# Altium schematic sheet Схема версия 3.1.SchDoc
size 594 x 420 mm; Author: ALTIUM GOSTBOM2.0 KEV; SheetNumber: 1; SheetTotal: 1; Обозначение_Код: НАПК0001.00.01Р; Наименование2: Модуль вычислительный; Вид_документа_SCH: Схема принципиальная; Наименование_организации: Неясыти Аэро; п_Разраб_Р: Хейфец С.С.; п_Пров_Р: Хрущев А.С.; п_Утв_Р: Хейфец С.С.
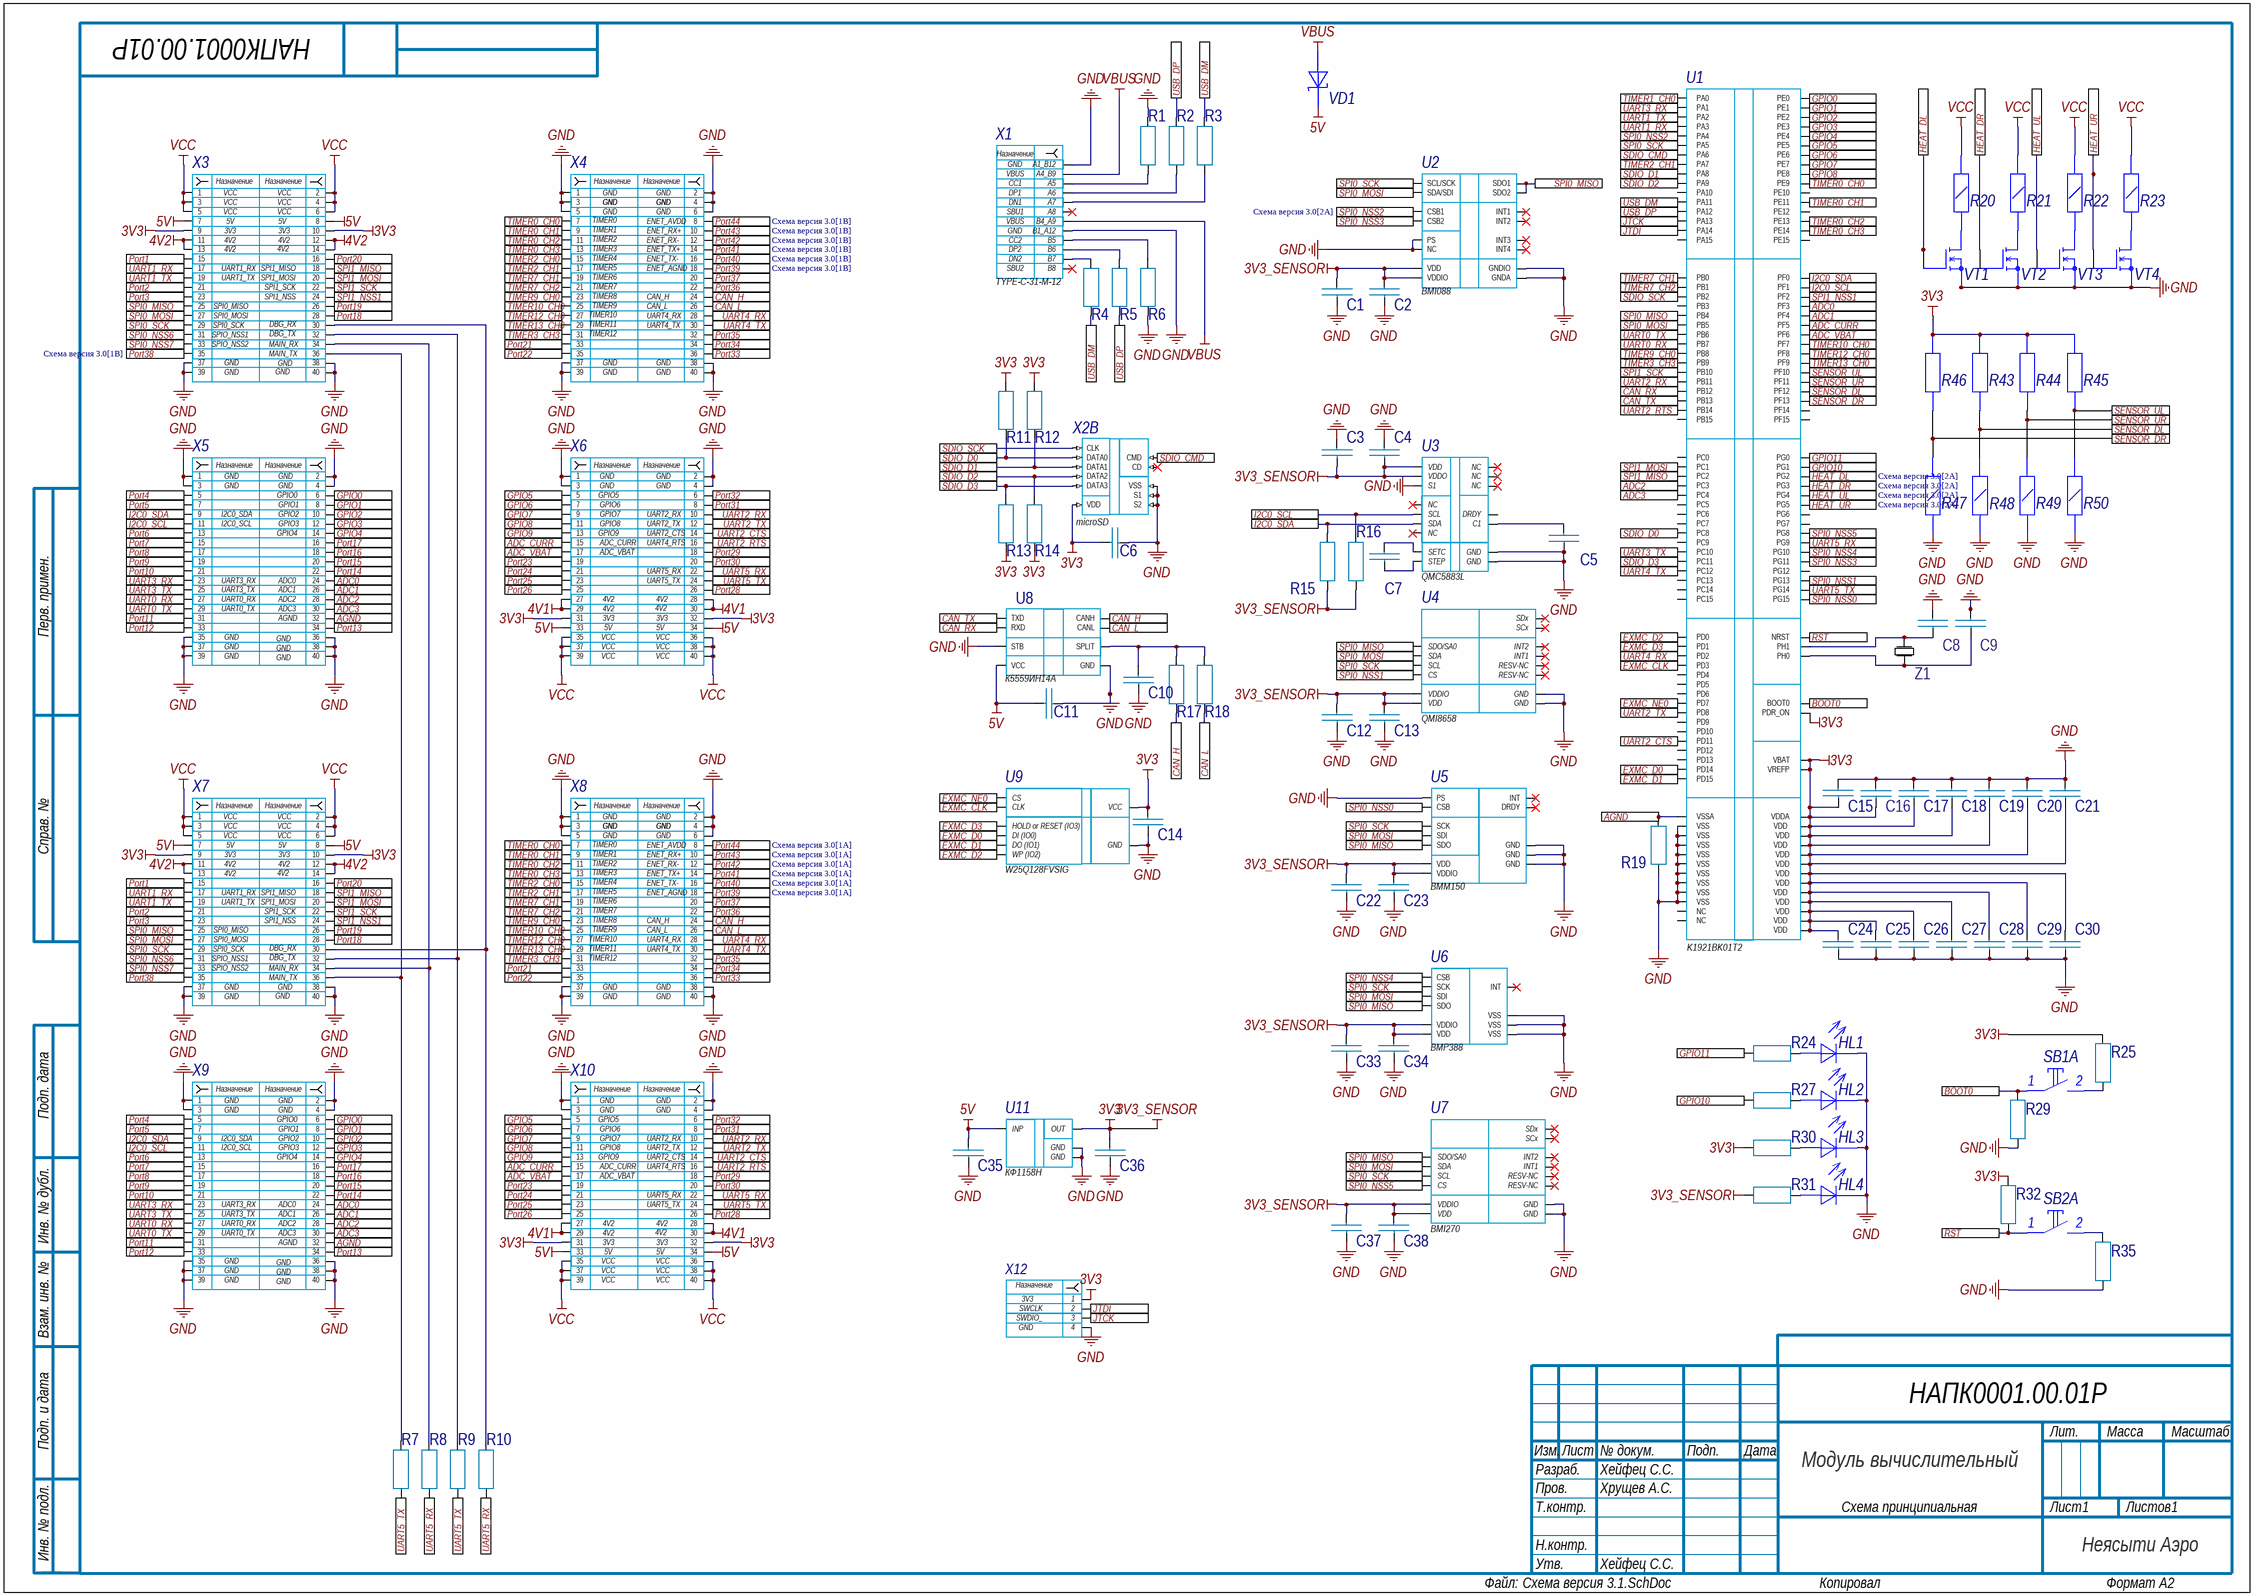
[diagram p0: Схема версия 3.1.SchDoc]

## Parts
C1  100nF  [C0603]  (value not drawn)
C2  100nF  [C0603]  (value not drawn)
C3  100nF  [C0603]  (value not drawn)
C4  100nF  [C0603]  (value not drawn)
C5  4u7F  [C1206]  (value not drawn)
C6  100nF  [C0603]  (value not drawn)
C7  200nF  [C0603]  (value not drawn)
C8  18pF  [C0603]  (value not drawn)
C9  18pF  [C0603]  (value not drawn)
C10  47nF  [C0603]  (value not drawn)
C11  100nF  [C0603]  (value not drawn)
C12  100nF  [C0603]  (value not drawn)
C13  100nF  [C0603]  (value not drawn)
C14  100nF  [C0603]  (value not drawn)
C15  100nF  [C0603]  (value not drawn)
C16  100nF  [C0603]  (value not drawn)
C17  100nF  [C0603]  (value not drawn)
C18  100nF  [C0603]  (value not drawn)
C19  100nf  [C0603]  (value not drawn)
C20  100nF  [C0603]  (value not drawn)
C21  100nF  [C0603]  (value not drawn)
C22  100nF  [C0603]  (value not drawn)
C23  100nF  [C0603]  (value not drawn)
C24  100nF  [C0603]  (value not drawn)
C25  100nF  [C0603]  (value not drawn)
C26  100nF  [C0603]  (value not drawn)
C27  100nF  [C0603]  (value not drawn)
C28  100nF  [C0603]  (value not drawn)
C29  100nF  [C0603]  (value not drawn)
C30  100nF  [C0603]  (value not drawn)
C33  100nF  [C0603]  (value not drawn)
C34  C1_POSTOYANNYJ  [C0603]  (value not drawn)
C35  1uF  [C0603]  (value not drawn)
C36  1uF  [C0603]  (value not drawn)
C37  C1_POSTOYANNYJ  [C0603]  (value not drawn)
C38  100nF  [C0603]  (value not drawn)
HL1  t  [LD0805]  (value not drawn)
HL2  t  [LD0805]  (value not drawn)
HL3  t  [LD0805]  (value not drawn)
HL4  t  [LD0805]  (value not drawn)
R1  5K1  [R0603]  (value not drawn)
R2  100  [R0603]  (value not drawn)
R3  100  [R0603]  (value not drawn)
R4  100  [R0603]  (value not drawn)
R5  100  [R0603]  (value not drawn)
R6  5K1  [R0603]  (value not drawn)
R7  0  [R0603]  (value not drawn)
R8  0  [R0603]  (value not drawn)
R9  0  [R0603]  (value not drawn)
R10  0  [R0603]  (value not drawn)
R11  100K  [R0603]  (value not drawn)
R12  100K  [R0603]  (value not drawn)
R13  100K  [R0603]  (value not drawn)
R14  100K  [R0603]  (value not drawn)
R15  10K  [R0603]  (value not drawn)
R16  10K  [R0603]  (value not drawn)
R17  60  [R0603]  (value not drawn)
R18  60  [R0603]  (value not drawn)
R19  0  [R0603]  (value not drawn)
R20  0020ab 1K8 2512  [R2512]  (value not drawn)
R21  0020ab 1K8 2512  [R2512]  (value not drawn)
R22  0020ab 1K8 2512  [R2512]  (value not drawn)
R23  0020ab 1K8 2512  [R2512]  (value not drawn)
R24  100  [R0603]  (value not drawn)
R25  10K  [R0603]  (value not drawn)
R27  100  [R0603]  (value not drawn)
R29  0  [R0603]  (value not drawn)
R30  100  [R0603]  (value not drawn)
R31  100  [R0603]  (value not drawn)
R32  10K  [R0603]  (value not drawn)
R35  0  [R0603]  (value not drawn)
R43  10K  [R0603]  (value not drawn)
R44  10K  [R0603]  (value not drawn)
R45  10K  [R0603]  (value not drawn)
R46  10K  [R0603]  (value not drawn)
R47  NCP15XH103F03RC  [R0603]  (value not drawn)
R48  NCP15XH103F03RC  [R0603]  (value not drawn)
R49  NCP15XH103F03RC  [R0603]  (value not drawn)
R50  NCP15XH103F03RC  [R0603]  (value not drawn)
SB1  Text  [DTSM-32]  (value not drawn)  (part A of 2)
SB2  Text  [DTSM-32]  (value not drawn)  (part A of 2)
U1  K1921BK01T2  [QFP50P2200X2200X160-144N]
U2  BMI088  [PQFN50P450X300X100-16N]
U3  QMC5883L  [PLCC16-0.5-3X3MM]
U4  QMI8658  [XDCR_BMI270]
U5  BMM150  [XDCR_BMM150]
U6  BMP388  [PQFN50P200X200X80-10N]
U7  BMI270  [XDCR_BMI270]
U8  К5559ИН14А  [SOIC127P600X175-8N]
U9  W25Q128FVSIG  [SOIC127P790X216-8N]
U11  КФ1158Н  [SOT-428]
VD1  Schottky  [SOD-123]  (value not drawn)
VT1  КТ234В9  [SOT-23]  (value not drawn)
VT2  КТ234В9  [SOT-23]  (value not drawn)
VT3  КТ234В9  [SOT-23]  (value not drawn)
VT4  КТ234В9  [SOT-23]  (value not drawn)
X1  TYPE-C-31-M-12  [HRO_TYPE-C-31-M-12]
X2  microSD  [MICROSD]  (part B of 2)
X3  Header 2x20  [PBD1.27-40SA]  (value not drawn)
X4  Header 2x20  [PBD1.27-40SA]  (value not drawn)
X5  Header 2x20  [PBD1.27-40SA]  (value not drawn)
X6  Header 2x20  [PBD1.27-40SA]  (value not drawn)
X7  Header 2x20  [Headr 2x20 female]  (value not drawn)
X8  Header 2x20  [Headr 2x20 female]  (value not drawn)
X9  Header 2x20  [Headr 2x20 female]  (value not drawn)
X10  Header 2x20  [Headr 2x20 female]  (value not drawn)
X12  Header 1x4  [PicoBlade 4pin]  (value not drawn)
Z1  KSE-7I08000MAF343ZA3  [XTAL_NX5032GA-8.000M-STD-CSU-1]  (value not drawn)

## Ports
ADC0 (see Схема версия 3.0[1A], Схема версия 3.0[1B]), ADC0 (see Схема версия 3.0[1A], Схема версия 3.0[2A]), ADC0 (see Схема версия 3.0[1B], Схема версия 3.0[2A]), ADC1 (see Схема версия 3.0[1A], Схема версия 3.0[1B]), ADC1 (see Схема версия 3.0[1A], Схема версия 3.0[2A]), ADC1 (see Схема версия 3.0[1B], Схема версия 3.0[2A]), ADC2 (see Схема версия 3.0[1A], Схема версия 3.0[1B]), ADC2 (see Схема версия 3.0[1A], Схема версия 3.0[2A]), ADC2 (see Схема версия 3.0[1B], Схема версия 3.0[2A]), ADC3 (see Схема версия 3.0[1A], Схема версия 3.0[1B]), ADC3 (see Схема версия 3.0[1A], Схема версия 3.0[2A]), ADC3 (see Схема версия 3.0[1B], Схема версия 3.0[2A]), ADC_CURR (see Схема версия 3.0[1A], Схема версия 3.0[1B]), ADC_CURR (see Схема версия 3.0[1A], Схема версия 3.0[2A]), ADC_CURR (see Схема версия 3.0[1B], Схема версия 3.0[2A]), ADC_VBAT (see Схема версия 3.0[1A], Схема версия 3.0[1B]), ADC_VBAT (see Схема версия 3.0[1A], Схема версия 3.0[2A]), ADC_VBAT (see Схема версия 3.0[1B], Схема версия 3.0[2A]), AGND (see Схема версия 3.0[1A], Схема версия 3.0[1B]), AGND (see Схема версия 3.0[1A], Схема версия 3.0[2B]), AGND (see Схема версия 3.0[1B], Схема версия 3.0[2B]), BOOT0 (see Схема версия 3.0[2A]), BOOT0 (see Схема версия 3.0[2B]), CAN_H (see Схема версия 3.0[1A], Схема версия 3.0[1B]), CAN_H (see Схема версия 3.0[1A], Схема версия 3.0[1B], Схема версия 3.0[2A]), CAN_H (see Схема версия 3.0[1A], Схема версия 3.0[2A]), CAN_L (see Схема версия 3.0[1A], Схема версия 3.0[1B]), CAN_L (see Схема версия 3.0[1A], Схема версия 3.0[1B], Схема версия 3.0[2A]), CAN_L (see Схема версия 3.0[1A], Схема версия 3.0[2A]), CAN_RX (see Схема версия 3.0[1A]), CAN_RX (see Схема версия 3.0[2A]), CAN_TX (see Схема версия 3.0[1A]), CAN_TX (see Схема версия 3.0[2A]), EXMC_CLK (see Схема версия 3.0[1B]), EXMC_CLK (see Схема версия 3.0[2A]), EXMC_D0 (see Схема версия 3.0[1B]), EXMC_D0 (see Схема версия 3.0[2A]), EXMC_D1 (see Схема версия 3.0[1B]), EXMC_D1 (see Схема версия 3.0[2A]), EXMC_D2 (see Схема версия 3.0[1B]), EXMC_D2 (see Схема версия 3.0[2A]), EXMC_D3 (see Схема версия 3.0[1B]), EXMC_D3 (see Схема версия 3.0[2A]), EXMC_NE0 (see Схема версия 3.0[1A]), EXMC_NE0 (see Схема версия 3.0[2A]), GPIO0 (see Схема версия 3.0[1A], Схема версия 3.0[1B]), GPIO0 (see Схема версия 3.0[1A], Схема версия 3.0[2A]), GPIO0 (see Схема версия 3.0[1B], Схема версия 3.0[2A]), GPIO1 (see Схема версия 3.0[1A], Схема версия 3.0[1B]), GPIO1 (see Схема версия 3.0[1A], Схема версия 3.0[2A]), GPIO1 (see Схема версия 3.0[1B], Схема версия 3.0[2A]), GPIO2 (see Схема версия 3.0[1A], Схема версия 3.0[1B]), GPIO2 (see Схема версия 3.0[1A], Схема версия 3.0[2A]), GPIO2 (see Схема версия 3.0[1B], Схема версия 3.0[2A]), GPIO3 (see Схема версия 3.0[1A], Схема версия 3.0[1B]), GPIO3 (see Схема версия 3.0[1A], Схема версия 3.0[2A]), GPIO3 (see Схема версия 3.0[1B], Схема версия 3.0[2A]), GPIO4 (see Схема версия 3.0[1A], Схема версия 3.0[1B]), GPIO4 (see Схема версия 3.0[1A], Схема версия 3.0[2A]), GPIO4 (see Схема версия 3.0[1B], Схема версия 3.0[2A]), GPIO5 (see Схема версия 3.0[1A], Схема версия 3.0[1B]), GPIO5 (see Схема версия 3.0[1A], Схема версия 3.0[2A]), GPIO5 (see Схема версия 3.0[1B], Схема версия 3.0[2A]), GPIO6 (see Схема версия 3.0[1A], Схема версия 3.0[1B]), GPIO6 (see Схема версия 3.0[1A], Схема версия 3.0[2A]), GPIO6 (see Схема версия 3.0[1B], Схема версия 3.0[2A]), GPIO7 (see Схема версия 3.0[1A], Схема версия 3.0[1B]), GPIO7 (see Схема версия 3.0[1A], Схема версия 3.0[2A]), GPIO7 (see Схема версия 3.0[1B], Схема версия 3.0[2A]), GPIO8 (see Схема версия 3.0[1A], Схема версия 3.0[1B]), GPIO8 (see Схема версия 3.0[1A], Схема версия 3.0[2A]), GPIO8 (see Схема версия 3.0[1B], Схема версия 3.0[2A]), GPIO9 (see Схема версия 3.0[1A]), GPIO9 (see Схема версия 3.0[1B]), GPIO10 (see Схема версия 3.0[2A]), GPIO10 (see Схема версия 3.0[2B]), GPIO11 (see Схема версия 3.0[2A]), GPIO11 (see Схема версия 3.0[2B]), HEAT_DL (see Схема версия 3.0[2A]), HEAT_DR (see Схема версия 3.0[2A]), HEAT_UL (see Схема версия 3.0[2A]), HEAT_UR (see Схема версия 3.0[2A]), I2C0_SCL (see Схема версия 3.0[1A], Схема версия 3.0[1B], Схема версия 3.0[2A]), I2C0_SCL (see Схема версия 3.0[1A], Схема версия 3.0[2A]), I2C0_SCL (see Схема версия 3.0[1B], Схема версия 3.0[2A]), I2C0_SDA (see Схема версия 3.0[1A], Схема версия 3.0[1B], Схема версия 3.0[2A]), I2C0_SDA (see Схема версия 3.0[1A], Схема версия 3.0[2A]), I2C0_SDA (see Схема версия 3.0[1B], Схема версия 3.0[2A]), JTCK (see Схема версия 3.0[1B]), JTCK (see Схема версия 3.0[2A]), JTDI (see Схема версия 3.0[1B]), JTDI (see Схема версия 3.0[2A]), Port1 (see Схема версия 3.0[1A]), Port1 (see Схема версия 3.0[1B]), Port2 (see Схема версия 3.0[1A]), Port2 (see Схема версия 3.0[1B]), Port3 (see Схема версия 3.0[1A]), Port3 (see Схема версия 3.0[1B]), Port4 (see Схема версия 3.0[1A]), Port4 (see Схема версия 3.0[1B]), Port5 (see Схема версия 3.0[1A]), Port5 (see Схема версия 3.0[1B]), Port6 (see Схема версия 3.0[1A]), Port6 (see Схема версия 3.0[1B]), Port7 (see Схема версия 3.0[1A]), Port7 (see Схема версия 3.0[1B]), Port8 (see Схема версия 3.0[1A]), Port8 (see Схема версия 3.0[1B]), Port9 (see Схема версия 3.0[1A]), Port9 (see Схема версия 3.0[1B]), Port10 (see Схема версия 3.0[1A]), Port10 (see Схема версия 3.0[1B]), Port11 (see Схема версия 3.0[1A]), Port11 (see Схема версия 3.0[1B]), Port12 (see Схема версия 3.0[1A]), Port12 (see Схема версия 3.0[1B]), Port13 (see Схема версия 3.0[1A]), Port13 (see Схема версия 3.0[1B]), Port14 (see Схема версия 3.0[1A]), Port14 (see Схема версия 3.0[1B]), Port15 (see Схема версия 3.0[1A]), Port15 (see Схема версия 3.0[1B]), Port16 (see Схема версия 3.0[1A]), Port16 (see Схема версия 3.0[1B]), Port17 (see Схема версия 3.0[1A]), Port17 (see Схема версия 3.0[1B]), Port18 (see Схема версия 3.0[1A]), Port18 (see Схема версия 3.0[1B]), Port19 (see Схема версия 3.0[1A]), Port19 (see Схема версия 3.0[1B]), Port20 (see Схема версия 3.0[1A]), Port20 (see Схема версия 3.0[1B]), Port21 (see Схема версия 3.0[1A]), Port21 (see Схема версия 3.0[1B]), Port22 (see Схема версия 3.0[1A]), Port22 (see Схема версия 3.0[1B]), Port23 (see Схема версия 3.0[1A]), Port23 (see Схема версия 3.0[1B]), Port24 (see Схема версия 3.0[1A]), Port24 (see Схема версия 3.0[1B]), Port25 (see Схема версия 3.0[1A]), Port25 (see Схема версия 3.0[1B]), Port26 (see Схема версия 3.0[1A]), Port26 (see Схема версия 3.0[1B]), Port28 (see Схема версия 3.0[1A]), Port28 (see Схема версия 3.0[1B]), Port29 (see Схема версия 3.0[1A]), Port29 (see Схема версия 3.0[1B]), Port30 (see Схема версия 3.0[1A]), Port30 (see Схема версия 3.0[1B]), Port31 (see Схема версия 3.0[1A]), Port31 (see Схема версия 3.0[1B]), Port32 (see Схема версия 3.0[1A]), Port32 (see Схема версия 3.0[1B]), Port33 (see Схема версия 3.0[1A]), Port33 (see Схема версия 3.0[1B]), Port34 (see Схема версия 3.0[1A]), Port34 (see Схема версия 3.0[1B]), Port35 (see Схема версия 3.0[1A]), Port35 (see Схема версия 3.0[1B]), Port36 (see Схема версия 3.0[1A]), Port36 (see Схема версия 3.0[1B]), Port37 (see Схема версия 3.0[1A]), Port37 (see Схема версия 3.0[1B]), Port38 (see Схема версия 3.0[1A]), Port38 (see Схема версия 3.0[1B]), Port39 (see Схема версия 3.0[1A]), Port39 (see Схема версия 3.0[1B]), Port40 (see Схема версия 3.0[1A]), Port40 (see Схема версия 3.0[1B]), Port41 (see Схема версия 3.0[1A]), Port41 (see Схема версия 3.0[1B]), Port42 (see Схема версия 3.0[1A]), Port42 (see Схема версия 3.0[1B]), Port43 (see Схема версия 3.0[1A]), Port43 (see Схема версия 3.0[1B]), Port44 (see Схема версия 3.0[1A]), Port44 (see Схема версия 3.0[1B]), RST (see Схема версия 3.0[2A]), RST (see Схема версия 3.0[2B]), SDIO_CMD (see Схема версия 3.0[2A]), SDIO_D0 (see Схема версия 3.0[1A]), SDIO_D0 (see Схема версия 3.0[2A]), SDIO_D1 (see Схема версия 3.0[1A]), SDIO_D1 (see Схема версия 3.0[2A]), SDIO_D2 (see Схема версия 3.0[1A]), SDIO_D2 (see Схема версия 3.0[2A]), SDIO_D3 (see Схема версия 3.0[1A]), SDIO_D3 (see Схема версия 3.0[2A]), SDIO_SCK (see Схема версия 3.0[1A]), SDIO_SCK (see Схема версия 3.0[2A]), SENSOR_DL (see Схема версия 3.0[2A]), SENSOR_DR (see Схема версия 3.0[2A]), SENSOR_UL (see Схема версия 3.0[2A]), SENSOR_UR (see Схема версия 3.0[2A]), SPI0_MISO (see Схема версия 3.0[1A], Схема версия 3.0[1B], Схема версия 3.0[2A], Схема версия 3.0[2B]), SPI0_MISO (see Схема версия 3.0[1A], Схема версия 3.0[2A], Схема версия 3.0[2B]), SPI0_MISO (see Схема версия 3.0[1B], Схема версия 3.0[2A], Схема версия 3.0[2B]), SPI0_MOSI (see Схема версия 3.0[1A], Схема версия 3.0[1B], Схема версия 3.0[2A], Схема версия 3.0[2B]), SPI0_MOSI (see Схема версия 3.0[1A], Схема версия 3.0[2A], Схема версия 3.0[2B]), SPI0_MOSI (see Схема версия 3.0[1B], Схема версия 3.0[2A], Схема версия 3.0[2B]), SPI0_NSS0 (see Схема версия 3.0[2A]), SPI0_NSS0 (see Схема версия 3.0[2B]), SPI0_NSS1 (see Схема версия 3.0[2A]), SPI0_NSS2 (see Схема версия 3.0[2A]), SPI0_NSS3 (see Схема версия 3.0[2A]), SPI0_NSS4 (see Схема версия 3.0[2A]), SPI0_NSS4 (see Схема версия 3.0[2B]), SPI0_NSS5 (see Схема версия 3.0[2A]), SPI0_NSS5 (see Схема версия 3.0[2B]), SPI0_NSS6 (see Схема версия 3.0[1A]), SPI0_NSS6 (see Схема версия 3.0[1B]), SPI0_NSS7 (see Схема версия 3.0[1A]), SPI0_NSS7 (see Схема версия 3.0[1B]), SPI0_SCK (see Схема версия 3.0[1A], Схема версия 3.0[1B], Схема версия 3.0[2A], Схема версия 3.0[2B]), SPI0_SCK (see Схема версия 3.0[1A], Схема версия 3.0[2A], Схема версия 3.0[2B]), SPI0_SCK (see Схема версия 3.0[1B], Схема версия 3.0[2A], Схема версия 3.0[2B]), SPI1_MISO (see Схема версия 3.0[1A], Схема версия 3.0[1B]), SPI1_MISO (see Схема версия 3.0[1A], Схема версия 3.0[2A]), SPI1_MISO (see Схема версия 3.0[1B], Схема версия 3.0[2A]), SPI1_MOSI (see Схема версия 3.0[1A], Схема версия 3.0[1B]), SPI1_MOSI (see Схема версия 3.0[1A], Схема версия 3.0[2A]), SPI1_MOSI (see Схема версия 3.0[1B], Схема версия 3.0[2A]), SPI1_NSS1 (see Схема версия 3.0[1A], Схема версия 3.0[1B]), SPI1_NSS1 (see Схема версия 3.0[1A], Схема версия 3.0[2A]), SPI1_NSS1 (see Схема версия 3.0[1B], Схема версия 3.0[2A]), SPI1_SCK (see Схема версия 3.0[1A], Схема версия 3.0[1B]), SPI1_SCK (see Схема версия 3.0[1A], Схема версия 3.0[2A]), SPI1_SCK (see Схема версия 3.0[1B], Схема версия 3.0[2A]), TIMER0_CH0 (see Схема версия 3.0[1A], Схема версия 3.0[1B]), TIMER0_CH0 (see Схема версия 3.0[1A], Схема версия 3.0[2A]), TIMER0_CH0 (see Схема версия 3.0[1B], Схема версия 3.0[2A]), TIMER0_CH1 (see Схема версия 3.0[1A], Схема версия 3.0[1B]), TIMER0_CH1 (see Схема версия 3.0[1A], Схема версия 3.0[2A]), TIMER0_CH1 (see Схема версия 3.0[1B], Схема версия 3.0[2A]), TIMER0_CH2 (see Схема версия 3.0[1A], Схема версия 3.0[1B]), TIMER0_CH2 (see Схема версия 3.0[1A], Схема версия 3.0[2A]), TIMER0_CH2 (see Схема версия 3.0[1B], Схема версия 3.0[2A]), TIMER0_CH3 (see Схема версия 3.0[1A], Схема версия 3.0[1B]), TIMER0_CH3 (see Схема версия 3.0[1A], Схема версия 3.0[2A]), TIMER0_CH3 (see Схема версия 3.0[1B], Схема версия 3.0[2A]), TIMER1_CH0, TIMER2_CH0 (see Схема версия 3.0[1A]), TIMER2_CH0 (see Схема версия 3.0[1B]), TIMER2_CH1 (see Схема версия 3.0[1A], Схема версия 3.0[1B]), TIMER2_CH1 (see Схема версия 3.0[1A], Схема версия 3.0[2A]), TIMER2_CH1 (see Схема версия 3.0[1B], Схема версия 3.0[2A]), TIMER3_CH3 (see Схема версия 3.0[1A], Схема версия 3.0[1B]), TIMER3_CH3 (see Схема версия 3.0[1A], Схема версия 3.0[2A]), TIMER3_CH3 (see Схема версия 3.0[1B], Схема версия 3.0[2A]), TIMER7_CH1 (see Схема версия 3.0[1A], Схема версия 3.0[1B]), TIMER7_CH1 (see Схема версия 3.0[1A], Схема версия 3.0[2A]), TIMER7_CH1 (see Схема версия 3.0[1B], Схема версия 3.0[2A]), TIMER7_CH2 (see Схема версия 3.0[1A], Схема версия 3.0[1B]), TIMER7_CH2 (see Схема версия 3.0[1A], Схема версия 3.0[2A]), TIMER7_CH2 (see Схема версия 3.0[1B], Схема версия 3.0[2A]), TIMER9_CH0 (see Схема версия 3.0[1A], Схема версия 3.0[1B]), TIMER9_CH0 (see Схема версия 3.0[1A], Схема версия 3.0[2A]), TIMER9_CH0 (see Схема версия 3.0[1B], Схема версия 3.0[2A]), TIMER10_CH0 (see Схема версия 3.0[1A], Схема версия 3.0[1B]), TIMER10_CH0 (see Схема версия 3.0[1A], Схема версия 3.0[2A]), TIMER10_CH0 (see Схема версия 3.0[1B], Схема версия 3.0[2A]), TIMER12_CH0 (see Схема версия 3.0[1A], Схема версия 3.0[1B]), TIMER12_CH0 (see Схема версия 3.0[1A], Схема версия 3.0[2A]), TIMER12_CH0 (see Схема версия 3.0[1B], Схема версия 3.0[2A]), TIMER13_CH0 (see Схема версия 3.0[1A], Схема версия 3.0[1B]), TIMER13_CH0 (see Схема версия 3.0[1A], Схема версия 3.0[2A]), TIMER13_CH0 (see Схема версия 3.0[1B], Схема версия 3.0[2A]), UART0_RX (see Схема версия 3.0[1A], Схема версия 3.0[1B]), UART0_RX (see Схема версия 3.0[1A], Схема версия 3.0[2A]), UART0_RX (see Схема версия 3.0[1B], Схема версия 3.0[2A]), UART0_TX (see Схема версия 3.0[1A], Схема версия 3.0[1B]), UART0_TX (see Схема версия 3.0[1A], Схема версия 3.0[2A]), UART0_TX (see Схема версия 3.0[1B], Схема версия 3.0[2A]), UART1_RX (see Схема версия 3.0[1A], Схема версия 3.0[1B]), UART1_RX (see Схема версия 3.0[1A], Схема версия 3.0[2A]), UART1_RX (see Схема версия 3.0[1B], Схема версия 3.0[2A]), UART1_TX (see Схема версия 3.0[1A], Схема версия 3.0[1B]), UART1_TX (see Схема версия 3.0[1A], Схема версия 3.0[2A]), UART1_TX (see Схема версия 3.0[1B], Схема версия 3.0[2A]), UART2_CTS (see Схема версия 3.0[1A], Схема версия 3.0[1B]), UART2_CTS (see Схема версия 3.0[1A], Схема версия 3.0[2A]), UART2_CTS (see Схема версия 3.0[1B], Схема версия 3.0[2A]), UART2_RTS (see Схема версия 3.0[1A], Схема версия 3.0[1B]), UART2_RTS (see Схема версия 3.0[1A], Схема версия 3.0[2A]), UART2_RTS (see Схема версия 3.0[1B], Схема версия 3.0[2A]), UART2_RX (see Схема версия 3.0[1A], Схема версия 3.0[1B]), UART2_RX (see Схема версия 3.0[1A], Схема версия 3.0[2A]), UART2_RX (see Схема версия 3.0[1B], Схема версия 3.0[2A]), UART2_TX (see Схема версия 3.0[1A], Схема версия 3.0[1B]), UART2_TX (see Схема версия 3.0[1A], Схема версия 3.0[2A]), UART2_TX (see Схема версия 3.0[1B], Схема версия 3.0[2A]), UART3_RX (see Схема версия 3.0[1A], Схема версия 3.0[1B]), UART3_RX (see Схема версия 3.0[1A], Схема версия 3.0[2A]), UART3_RX (see Схема версия 3.0[1B], Схема версия 3.0[2A]), UART3_TX (see Схема версия 3.0[1A], Схема версия 3.0[1B]), UART3_TX (see Схема версия 3.0[1A], Схема версия 3.0[2A]), UART3_TX (see Схема версия 3.0[1B], Схема версия 3.0[2A]), UART4_RX (see Схема версия 3.0[1A], Схема версия 3.0[1B]), UART4_RX (see Схема версия 3.0[1A], Схема версия 3.0[2A]), UART4_RX (see Схема версия 3.0[1B], Схема версия 3.0[2A]), UART4_TX (see Схема версия 3.0[1A], Схема версия 3.0[1B]), UART4_TX (see Схема версия 3.0[1A], Схема версия 3.0[2A]), UART4_TX (see Схема версия 3.0[1B], Схема версия 3.0[2A]), UART5_RX (see Схема версия 3.0[1A], Схема версия 3.0[1B]), UART5_RX (see Схема версия 3.0[1A], Схема версия 3.0[1B], Схема версия 3.0[2A]), UART5_RX (see Схема версия 3.0[1B], Схема версия 3.0[2A]), UART5_TX (see Схема версия 3.0[1A], Схема версия 3.0[1B]), UART5_TX (see Схема версия 3.0[1A], Схема версия 3.0[1B], Схема версия 3.0[2A]), UART5_TX (see Схема версия 3.0[1B], Схема версия 3.0[2A]), USB_DM (see Схема версия 3.0[1A], Схема версия 3.0[2A]), USB_DM (see Схема версия 3.0[2A]), USB_DP (see Схема версия 3.0[1A], Схема версия 3.0[2A]), USB_DP (see Схема версия 3.0[2A])

## Nets
3V3: C1.1 C2.1 C3.1 C4.1 C6.1 C12.1 C13.1 C14.2 C15.2 C16.2 C17.2 C18.2 C19.2 C20.2 C21.1 C22.1 C23.1 C24.1 C25.1 C26.1 C27.1 C28.1 C29.1 C30.1 C33.1 C34.1 C36.2 C37.1 C38.1 R11.1 R12.1 R13.1 R14.2 R15.1 R16.1 R25.2 R30.1 R31.1 R32.2 R43.2 R44.2 R45.2 R46.2 U1.6(VBAT) U1.17(VDD) U1.30(VDD) U1.32(VREFP) U1.33(VDDA) U1.39(VDD) U1.52(VDD) U1.62(VDD) U1.72(VDD) U1.84(VDD) U1.95(VDD) U1.108(VDD) U1.121(VDD) U1.131(VDD) U1.143(PDR_ON) U1.144(VDD) U2.3(VDD) U2.11(VDDIO) U3.2(VDD) U3.13(VDDO) U4.5(VDDIO) U4.8(VDD) U5.B2(VDDIO) U5.E5(VDD) U6.1(VDDIO) U6.10(VDD) U7.5(VDDIO) U7.8(VDD) U9.8(VCC) U11.3(OUT) X2.4(VDD) X3.9 X3.10 X6.31 X6.32 X7.9 X7.10 X10.31 X10.32 X12.1  [also labelled 3V3_SENSOR]
4V1: X6.27 X6.28 X6.29 X6.30 X10.27 X10.28 X10.29 X10.30
4V2: X3.11 X3.12 X3.13 X3.14 X7.11 X7.12 X7.13 X7.14
5V: C11.1 C35.2 U8.3(VCC) U11.1(INP) VD1.2(К) X3.7 X3.8 X6.33 X6.34 X7.7 X7.8 X10.33 X10.34
GND: C1.2 C2.2 C3.2 C4.2 C5.1 C6.2 C8.1 C9.1 C10.1 C11.2 C12.2 C13.2 C14.1 C15.1 C16.1 C17.1 C18.1 C19.1 C20.1 C21.2 C22.2 C23.2 C24.2 C25.2 C26.2 C27.2 C28.2 C29.2 C30.2 C33.2 C34.2 C35.1 C36.1 C37.2 C38.2 HL1.2(К) HL2.2(К) HL3.2(К) HL4.2(К) R1.2 R6.2 R19.1 R29.1 R35.1 R47.2 R48.2 R49.2 R50.2 U1.16(VSS) U1.38(VSS) U1.51(VSS) U1.61(VSS) U1.83(VSS) U1.94(VSS) U1.107(VSS) U1.120(VSS) U1.130(VSS) U2.2(NC) U2.4(GNDA) U2.6(GNDIO) U2.7(PS) U3.4(S1) U3.9(GND) U3.11(GND) U4.6(GND) U4.7(GND) U5.A1(PS) U5.C5(GND) U5.E1(GND) U5.E3(GND) U6.3(VSS) U6.8(VSS) U6.9(VSS) U7.6(GND) U7.7(GND) U8.2(GND) U8.8(STB) U9.4(GND) U11.2(GND) U11.4(GND) VT1.3(S) VT2.3(S) VT3.3(S) VT4.3(S) X1.A1_B12 X1.B1_A12 X2.6(VSS) X2.S1 X2.S2 X3.37 X3.38 X3.39 X3.40 X4.1 X4.2 X4.3 X4.4 X4.5 X4.6 X4.37 X4.38 X4.39 X4.40 X5.1 X5.2 X5.3 X5.4 X5.35 X5.36 X5.37 X5.38 X5.39 X5.40 X6.1 X6.2 X6.3 X6.4 X7.37 X7.38 X7.39 X7.40 X8.1 X8.2 X8.3 X8.4 X8.5 X8.6 X8.37 X8.38 X8.39 X8.40 X9.1 X9.2 X9.3 X9.4 X9.35 X9.36 X9.37 X9.38 X9.39 X9.40 X10.1 X10.2 X10.3 X10.4 X12.4
VBUS: VD1.1(А) X1.A4_B9 X1.B4_A9
VCC: R20.1 R21.1 R22.1 R23.1 X3.1 X3.2 X3.3 X3.4 X3.5 X3.6 X6.35 X6.36 X6.37 X6.38 X6.39 X6.40 X7.1 X7.2 X7.3 X7.4 X7.5 X7.6 X10.35 X10.36 X10.37 X10.38 X10.39 X10.40
ADC0: U1.13(PF3) X5.24 X9.24 ; port ADC0
ADC1: U1.14(PF4) X5.26 X9.26 ; port ADC1
ADC2: U1.29(PC3) X5.28 X9.28 ; port ADC2
ADC3: U1.44(PC4) X5.30 X9.30 ; port ADC3
ADC_CURR: U1.15(PF5) X6.15 X10.15 ; port ADC_CURR
ADC_VBAT: U1.18(PF6) X6.17 X10.17 ; port ADC_VBAT
AGND: R19.2 U1.31(VSSA) X5.32 X9.32 ; port AGND
BOOT0: R29.2 SB1.1 U1.138(BOOT0) ; port BOOT0
CAN_H: R17.1 U8.7(CANH) X4.24 X8.24 ; port CAN_H
CAN_L: R18.2 U8.6(CANL) X4.26 X8.26 ; port CAN_L
CAN_RX: U1.73(PB12) U8.4(RXD) ; port CAN_RX
CAN_TX: U1.74(PB13) U8.1(TXD) ; port CAN_TX
EXMC_CLK: U1.117(PD3) U9.6(CLK) ; port EXMC_CLK
EXMC_D0: U1.85(PD14) U9.5(DI_(IO0)) ; port EXMC_D0
EXMC_D1: U1.86(PD15) U9.2(DO_(IO1)) ; port EXMC_D1
EXMC_D2: U1.114(PD0) U9.3(WP_(IO2)) ; port EXMC_D2
EXMC_D3: U1.115(PD1) U9.7(HOLD_or_RESET_(IO3)) ; port EXMC_D3
EXMC_NE0: U1.123(PD7) U9.1(CS) ; port EXMC_NE0
GPIO0: U1.141(PE0) X5.6 X9.6 ; port GPIO0
GPIO1: U1.142(PE1) X5.8 X9.8 ; port GPIO1
GPIO2: U1.1(PE2) X5.10 X9.10 ; port GPIO2
GPIO3: U1.2(PE3) X5.12 X9.12 ; port GPIO3
GPIO4: U1.3(PE4) X5.14 X9.14 ; port GPIO4
GPIO5: U1.4(PE5) X6.5 X10.5 ; port GPIO5
GPIO6: U1.5(PE6) X6.7 X10.7 ; port GPIO6
GPIO7: U1.58(PE7) X6.9 X10.9 ; port GPIO7
GPIO8: U1.59(PE8) X6.11 X10.11 ; port GPIO8
GPIO9: X6.13 X10.13 ; port GPIO9
GPIO10: R27.1 U1.57(PG1) ; port GPIO10
GPIO11: R24.1 U1.56(PG0) ; port GPIO11
HEAT_DL: U1.87(PG2) VT1.1(G) ; port HEAT_DL
HEAT_DR: U1.88(PG3) VT2.1(G) ; port HEAT_DR
HEAT_UL: U1.89(PG4) VT3.1(G) ; port HEAT_UL
HEAT_UR: U1.90(PG5) VT4.1(G) ; port HEAT_UR
I2C0_SCL: R16.2 U1.11(PF1) U3.1(SCL) X5.11 X9.11 ; port I2C0_SCL
I2C0_SDA: R15.2 U1.10(PF0) U3.16(SDA) X5.9 X9.9 ; port I2C0_SDA
JTCK: U1.105(PA13) X12.3 ; port JTCK
JTDI: U1.109(PA14) X12.2 ; port JTDI
Port1: X3.15 X7.15 ; port Port1
Port2: X3.21 X7.21 ; port Port2
Port3: X3.23 X7.23 ; port Port3
Port4: X5.5 X9.5 ; port Port4
Port5: X5.7 X9.7 ; port Port5
Port6: X5.13 X9.13 ; port Port6
Port7: X5.15 X9.15 ; port Port7
Port8: X5.17 X9.17 ; port Port8
Port9: X5.19 X9.19 ; port Port9
Port10: X5.21 X9.21 ; port Port10
Port11: X5.31 X9.31 ; port Port11
Port12: X5.33 X9.33 ; port Port12
Port13: X5.34 X9.34 ; port Port13
Port14: X5.22 X9.22 ; port Port14
Port15: X5.20 X9.20 ; port Port15
Port16: X5.18 X9.18 ; port Port16
Port17: X5.16 X9.16 ; port Port17
Port18: X3.28 X7.28 ; port Port18
Port19: X3.26 X7.26 ; port Port19
Port20: X3.16 X7.16 ; port Port20
Port21: X4.33 X8.33 ; port Port21
Port22: X4.35 X8.35 ; port Port22
Port23: X6.19 X10.19 ; port Port23
Port24: X6.21 X10.21 ; port Port24
Port25: X6.23 X10.23 ; port Port25
Port26: X6.25 X10.25 ; port Port26
Port28: X6.26 X10.26 ; port Port28
Port29: X6.18 X10.18 ; port Port29
Port30: X6.20 X10.20 ; port Port30
Port31: X6.8 X10.8 ; port Port31
Port32: X6.6 X10.6 ; port Port32
Port33: X4.36 X8.36 ; port Port33
Port34: X4.34 X8.34 ; port Port34
Port35: X4.32 X8.32 ; port Port35
Port36: X4.22 X8.22 ; port Port36
Port37: X4.20 X8.20 ; port Port37
Port38: X3.35 X7.35 ; port Port38
Port39: X4.18 X8.18 ; port Port39
Port40: X4.16 X8.16 ; port Port40
Port41: X4.14 X8.14 ; port Port41
Port42: X4.12 X8.12 ; port Port42
Port43: X4.10 X8.10 ; port Port43
Port44: X4.8 X8.8 ; port Port44
RST: R32.1 SB2.1 U1.25(NRST) ; port RST
SDIO_CMD: U1.42(PA6) X2.3(CMD) ; port SDIO_CMD
SDIO_D0: R11.2 U1.98(PC8) X2.7(DATA0) ; port SDIO_D0
SDIO_D1: R12.2 U1.100(PA8) X2.8(DATA1) ; port SDIO_D1
SDIO_D2: R14.1 U1.101(PA9) X2.1(DATA2) ; port SDIO_D2
SDIO_D3: R13.2 U1.112(PC11) X2.2(DATA3) ; port SDIO_D3
SDIO_SCK: U1.48(PB2) X2.5(CLK) ; port SDIO_SCK
SENSOR_DL: R43.1 R48.1 U1.50(PF12) ; port SENSOR_DL
SENSOR_DR: R46.1 R47.1 U1.53(PF13) ; port SENSOR_DR
SENSOR_UL: R45.1 R50.1 U1.22(PF10) ; port SENSOR_UL
SENSOR_UR: R44.1 R49.1 U1.49(PF11) ; port SENSOR_UR
SPI0_MISO: U1.134(PB4) U2.10(SDO2) U2.15(SDO1) U4.1(SDO/SA0) U5.C1(SDO) U6.5(SDO) U7.1(SDO/SA0) X3.25 X7.25 ; port SPI0_MISO
SPI0_MOSI: U1.135(PB5) U2.9(SDA/SDI) U4.14(SDA) U5.B4(SDI) U6.4(SDI) U7.14(SDA) X3.27 X7.27 ; port SPI0_MOSI
SPI0_NSS0: U1.132(PG15) U5.A5(CSB) ; port SPI0_NSS0
SPI0_NSS1: U1.128(PG13) U4.12(CS) ; port SPI0_NSS1
SPI0_NSS2: U1.40(PA4) U2.14(CSB1) ; port SPI0_NSS2
SPI0_NSS3: U1.126(PG11) U2.5(CSB2) ; port SPI0_NSS3
SPI0_NSS4: U1.125(PG10) U6.6(CSB) ; port SPI0_NSS4
SPI0_NSS5: U1.93(PG8) U7.12(CS) ; port SPI0_NSS5
SPI0_NSS6: X3.31 X7.31 ; port SPI0_NSS6
SPI0_NSS7: X3.33 X7.33 ; port SPI0_NSS7
SPI0_SCK: U1.41(PA5) U2.8(SCL/SCK) U4.13(SCL) U5.A3(SCK) U6.2(SCK) U7.13(SCL) X3.29 X7.29 ; port SPI0_SCK
SPI1_MISO: U1.28(PC2) X3.18 X7.18 ; port SPI1_MISO
SPI1_MOSI: U1.27(PC1) X3.20 X7.20 ; port SPI1_MOSI
SPI1_NSS1: U1.12(PF2) X3.24 X7.24 ; port SPI1_NSS1
SPI1_SCK: U1.69(PB10) X3.22 X7.22 ; port SPI1_SCK
TIMER0_CH0: U1.60(PE9) X4.7 X8.7 ; port TIMER0_CH0
TIMER0_CH1: U1.64(PE11) X4.9 X8.9 ; port TIMER0_CH1
TIMER0_CH2: U1.66(PE13) X4.11 X8.11 ; port TIMER0_CH2
TIMER0_CH3: U1.67(PE14) X4.13 X8.13 ; port TIMER0_CH3
TIMER1_CH0: U1.34(PA0) ; port TIMER1_CH0
TIMER2_CH0: X4.15 X8.15 ; port TIMER2_CH0
TIMER2_CH1: U1.43(PA7) X4.17 X8.17 ; port TIMER2_CH1
TIMER3_CH3: U1.140(PB9) X4.31 X8.31 ; port TIMER3_CH3
TIMER7_CH1: U1.46(PB0) X4.19 X8.19 ; port TIMER7_CH1
TIMER7_CH2: U1.47(PB1) X4.21 X8.21 ; port TIMER7_CH2
TIMER9_CH0: U1.139(PB8) X4.23 X8.23 ; port TIMER9_CH0
TIMER10_CH0: U1.19(PF7) X4.25 X8.25 ; port TIMER10_CH0
TIMER12_CH0: U1.20(PF8) X4.27 X8.27 ; port TIMER12_CH0
TIMER13_CH0: U1.21(PF9) X4.29 X8.29 ; port TIMER13_CH0
UART0_RX: U1.137(PB7) X5.27 X9.27 ; port UART0_RX
UART0_TX: U1.136(PB6) X5.29 X9.29 ; port UART0_TX
UART1_RX: U1.37(PA3) X3.17 X7.17 ; port UART1_RX
UART1_TX: U1.36(PA2) X3.19 X7.19 ; port UART1_TX
UART2_CTS: U1.80(PD11) X6.14 X10.14 ; port UART2_CTS
UART2_RTS: U1.75(PB14) X6.16 X10.16 ; port UART2_RTS
UART2_RX: U1.70(PB11) X6.10 X10.10 ; port UART2_RX
UART2_TX: U1.77(PD8) X6.12 X10.12 ; port UART2_TX
UART3_RX: U1.35(PA1) X5.23 X9.23 ; port UART3_RX
UART3_TX: U1.111(PC10) X5.25 X9.25 ; port UART3_TX
UART4_RX: U1.116(PD2) X4.28 X8.28 ; port UART4_RX
UART4_TX: U1.113(PC12) X4.30 X8.30 ; port UART4_TX
UART5_RX: R8.2 R10.2 U1.124(PG9) X6.22 X10.22 ; port UART5_RX
UART5_TX: R7.1 R9.2 U1.129(PG14) X6.24 X10.24 ; port UART5_TX
USB_DM: R3.2 R4.2 U1.103(PA11) ; port USB_DM
USB_DP: R2.2 R5.2 U1.104(PA12) ; port USB_DP
NetC5_2: C5.2 U3.10(C1)
NetC7_1: C7.1 U3.12(SETC)
NetC7_2: C7.2 U3.8(STEP)
NetC8_2: C8.2 U1.24(PH1) Z1.2(X2)
NetC9_2: C9.2 U1.23(PH0) Z1.1(X1)
NetC10_2: C10.2 R17.2 R18.1 U8.5(SPLIT)
NetHL1_1: HL1.1(А) R24.2
NetHL2_1: HL2.1(А) R27.2
NetHL3_1: HL3.1(А) R30.2
NetHL4_1: HL4.1(А) R31.2
NetR1_1: R1.1 X1.A5
NetR2_1: R2.1 X1.A6
NetR3_1: R3.1 X1.A7
NetR4_1: R4.1 X1.B7
NetR5_1: R5.1 X1.B6
NetR6_1: R6.1 X1.B5
NetR7_2: R7.2 X3.36 X7.36
NetR8_1: R8.1 X3.34 X7.34
NetR9_1: R9.1 X3.32 X7.32
NetR10_1: R10.1 X3.30 X7.30
NetR20_2: R20.2 VT1.2(D)
NetR21_2: R21.2 VT2.2(D)
NetR22_2: R22.2 VT3.2(D)
NetR23_2: R23.2 VT4.2(D)
NetR25_1: R25.1 SB1.2
NetR35_2: R35.2 SB2.2

Not connected (* = marked no-connect by the designer): U1 7(PC13) 8(PC14) 9(PC15) 26(PC0) 45(PC5) 54(PF14) 55(PF15) 63(PE10) 65(PE12) 68(PE15) 71(NC_) 76(PB15) 78(PD9) 79(PD10) 81(PD12) 82(PD13) 91(PG6) 92(PG7) 96(PC6) 97(PC7) 99(PC9) 102(PA10) 106(NC) 110(PA15) 118(PD4) 119(PD5) 122(PD6) 127(PG12) 133(PB3); U2 1(INT2)* 12(INT3)* 13(INT4)* 16(INT1)*; U3 3(NC)* 5(NC)* 6(NC)* 7(NC)* 14(NC)* 15(DRDY); U4 2(SDx)* 3(SCx)* 4(INT1)* 9(INT2)* 10(RESV-NC)* 11(RESV-NC)*; U5 D2(INT)* D4(DRDY)*; U6 7(INT)*; U7 2(SDx)* 3(SCx)* 4(INT1)* 9(INT2)* 10(RESV-NC)* 11(RESV-NC)*; X1 A8* B8*; X2 11(CD)*

## Notes on the sheet
- (near X3) VCC
- (near X3) 5V
- (near X4) TIMER0
- (near X4) GND
- (near X4) ENET_AVDD
- (near X3) UART1_RX
- (near X3) 3V3
- (near X3) 4V2
- (near X3) SPI1_MISO
- (near X4) TIMER1
- (near X4) TIMER2
- (near X4) TIMER3
- (near X4) TIMER4
- (near X4) TIMER5
- (near X4) ENET_RX+
- (near X4) ENET_RX-
- (near X4) ENET_TX+
- (near X4) ENET_TX-
- (near X4) ENET_AGND
- (near X3) UART1_TX
- (near X3) SPI0_MISO
- (near X3) SPI0_MOSI
- (near X3) SPI1_MOSI
- (near X3) SPI1_SCK
- (near X3) SPI1_NSS
- (near X4) TIMER6
- (near X4) TIMER7
- (near X4) TIMER8
- (near X4) TIMER9
- (near X4) TIMER10
- (near X4) CAN_H
- (near X4) CAN_L
- (near X4) UART4_RX
- (near X3) GND
- (near X3) SPI0_SCK
- (near X3) SPIO_NSS1
- (near X3) SPIO_NSS2
- (near X3) MAIN_RX
- (near X3) MAIN_TX
- (near X3) DBG_RX
- (near X3) DBG_TX
- (near X4) TIMER11
- (near X4) TIMER12
- (near X4) UART4_TX
- (near X5) GND
- (near X5) GPIO1
- (near X5) GPIO0
- (near X6) GPIO6
- (near X6) GND
- (near X6) GPIO5
- (near X5) I2C0_SDA
- (near X5) I2C0_SCL
- (near X5) GPIO2
- (near X5) GPIO3
- (near X5) GPIO4
- (near X6) GPIO7
- (near X6) GPIO8
- (near X6) ADC_CURR
- (near X6) ADC_VBAT
- (near X6) GPIO9
- (near X6) UART2_RX
- (near X6) UART2_TX
- (near X6) UART2_CTS
- (near X6) UART4_RTS
- (near X5) UART3_RX
- (near X5) UART3_TX
- (near X5) UART0_RX
- (near X5) ADC0
- (near X5) ADC1
- (near X5) ADC2
- (near X6) 4V2
- (near X6) UART5_RX
- (near X6) UART5_TX
- (near X5) UART0_TX
- (near X5) ADC3
- (near X5) AGND
- (near X6) VCC
- (near X6) 5V
- (near X6) 3V3
- (near X7) VCC
- (near X7) 5V
- (near X8) TIMER0
- (near X8) GND
- (near X8) ENET_AVDD
- (near X7) UART1_RX
- (near X7) 3V3
- (near X7) 4V2
- (near X7) SPI1_MISO
- (near X8) TIMER1
- (near X8) TIMER2
- (near X8) TIMER3
- (near X8) TIMER4
- (near X8) TIMER5
- (near X8) ENET_RX+
- (near X8) ENET_RX-
- (near X8) ENET_TX+
- (near X8) ENET_TX-
- (near X8) ENET_AGND
- (near X7) UART1_TX
- (near X7) SPI0_MISO
- (near X7) SPI0_MOSI
- (near X7) SPI1_MOSI
- (near X7) SPI1_SCK
- (near X7) SPI1_NSS
- (near X8) TIMER6
- (near X8) TIMER7
- (near X8) TIMER8
- (near X8) TIMER9
- (near X8) TIMER10
- (near X8) CAN_H
- (near X8) CAN_L
- (near X8) UART4_RX
- (near X7) GND
- (near X7) SPI0_SCK
- (near X7) SPIO_NSS1
- (near X7) SPIO_NSS2
- (near X7) MAIN_RX
- (near X7) MAIN_TX
- (near X7) DBG_RX
- (near X7) DBG_TX
- (near X8) TIMER11
- (near X8) TIMER12
- (near X8) UART4_TX
- (near X9) GND
- (near X9) GPIO1
- (near X9) GPIO0
- (near X10) GPIO6
- (near X10) GND
- (near X10) GPIO5
- (near X9) I2C0_SDA
- (near X9) I2C0_SCL
- (near X9) GPIO2
- (near X9) GPIO3
- (near X9) GPIO4
- (near X10) GPIO7
- (near X10) GPIO8
- (near X10) ADC_CURR
- (near X10) ADC_VBAT
- (near X10) GPIO9
- (near X10) UART2_RX
- (near X10) UART2_TX
- (near X10) UART2_CTS
- (near X10) UART4_RTS
- (near X9) UART3_RX
- (near X9) UART3_TX
- (near X9) UART0_RX
- (near X9) ADC0
- (near X9) ADC1
- (near X9) ADC2
- (near X10) 4V2
- (near X10) UART5_RX
- (near X10) UART5_TX
- (near X9) UART0_TX
- (near X9) ADC3
- (near X9) AGND
- (near X10) VCC
- (near X10) 5V
- (near X10) 3V3
- 3V3
- GND
- (near X12) SWCLK
- (near X12) SWDIO_
- Перв. примен.
- Справ. №
- Подп. дата
- Инв. № дубл.
- Взам. инв. №
- Подп. и дата
- Изм.
- Разраб.
- Лист
- № докум.
- Подп.
- Дата
- Лит.
- Масса
- Масштаб
- Пров.
- Т.контр.
- Листов
- Инв. № подл.
- Н.контр.
- Утв.
- ALTIUM GOSTBOM2.0 KEV
- Файл:
- Копировал
- Формат А2
- (in symbol Header 1x4) Назначение
- (in symbol Header 2x20) Назначение
- (in symbol TYPE-C-31-M-12) Назначение; GND; VBUS; CC1; DP1; DN1; SBU1; CC2; DP2; DN2; SBU2

## Library data of the parts
C1-C30 C33-C38 = C1_POSTOYANNYJ: Конденсатор постоянной емкости
HL1-HL4 = Led-1: Type: Индикатор единичный; Published: 03.12.2013; Publisher: Andrew Danich
R1-R19 R24 R25 R27 R29-R32 R35 = R1_POSTOYANNYJ: Резистор постоянный
R20-R23 R47-R50 = Resistor_0,25W: Published: 19.09.2014; Publisher: Andrew Danich; Type: Резистор
R43-R46 = Resistor: Published: 24.03.2010; Publisher: Andrew Danich; Type: Резистор
SB1 SB2 = BT-01x-01p-LED: Published: 17.04.2014; Publisher: Andrew Danich; Type: Переключатель
U1 = K1921BK01T2: MCU
U2 = BMI088: IMU
U3 = QMC5883L: Compass
U4 U7 = QMI8658: IMU
U5 = BMM150: Compass
U6 = BMP388: Barometer
U8 = TJA1040T: CAN-Transciever
U9 = W25Q128FVSIG: Memory 4MB
U11 = КФ1158Н: LDO
VD1 = Schottky: Type: Диод; Published: 18.05.2010; Publisher: Andrew Danich
VT1-VT4 = MOSFET-N: Type: Транзистор; Published: 24.09.2010; Publisher: Andrew Danich
X2 = MICROSD: Описание свойств компонента
Z1 = KX-38T